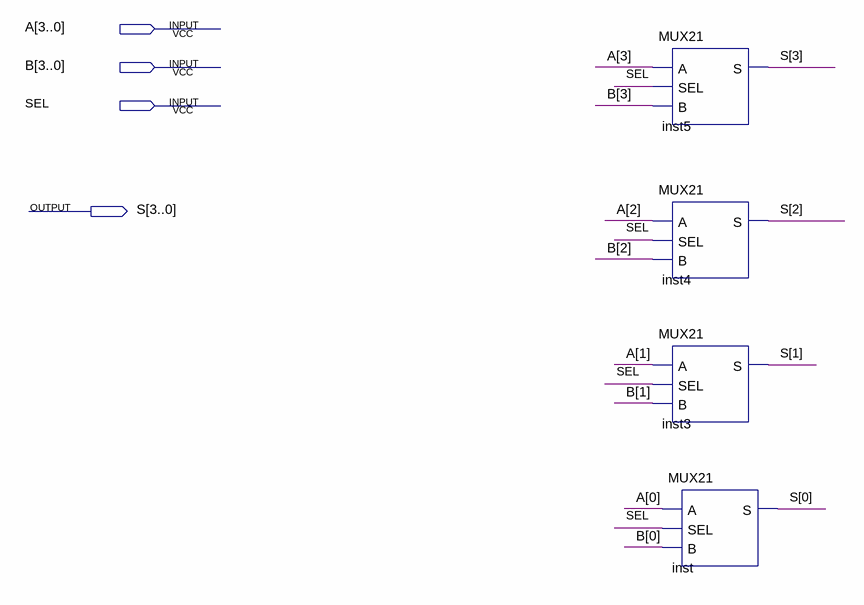
[diagram p0: schematic sheet]
// Quartus schematic MUX21_4BITS.bdf as structural Verilog: 4 symbols, 4 pins
module MUX21_4BITS (
  input  [3:0] A,
  input  [3:0] B,
  input  SEL,
  output [3:0] S
);

  MUX21 inst5 (.A(A[3]), .SEL(SEL), .B(B[3]), .S(S[3]));
  MUX21 inst4 (.A(A[2]), .SEL(SEL), .B(B[2]), .S(S[2]));
  MUX21 inst3 (.A(A[1]), .SEL(SEL), .B(B[1]), .S(S[1]));
  MUX21 inst (.A(A[0]), .SEL(SEL), .B(B[0]), .S(S[0]));
endmodule
